# EAGLE design K0N16_Keypad_v1_1 (EAGLE 9.6.2)

## Sheet 1 of 2: MCU and Power Supply
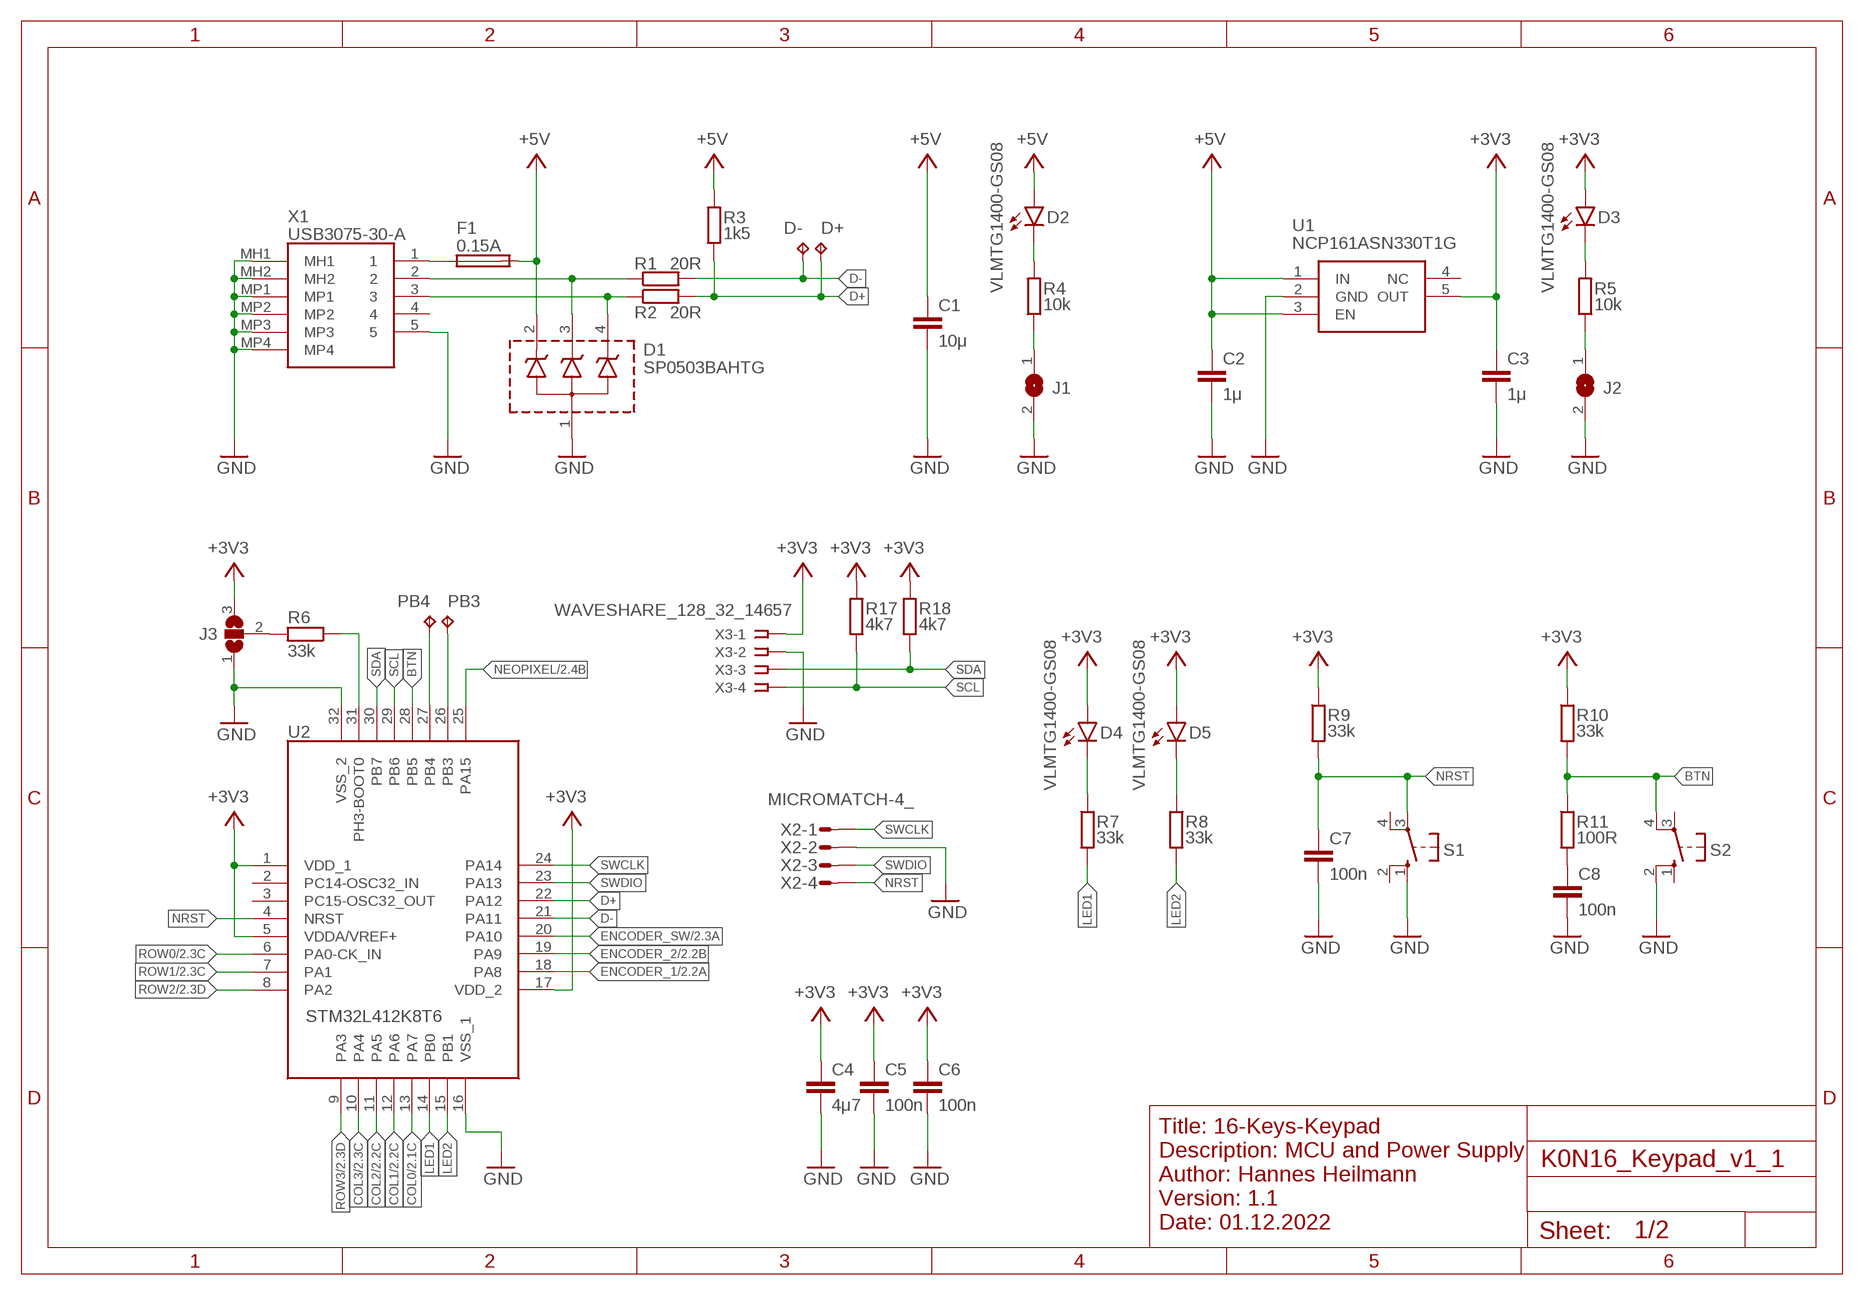
[diagram p0: schematic, sheet 1]

### Parts
C1  10μ  C_1206C1206  [C1206]
C2  1μ  C_0805  [C0805]
C3  1μ  C_0805  [C0805]
C4  4μ7  C_0805  [C0805]
C5  100n  C_0805  [C0805]
C6  100n  C_0805  [C0805]
C7  100n  C_0805  [C0805]
C8  100n  C_0805  [C0805]
D1  SP0503BAHTG  [SP0503BAHTG]
D2  VLMTG1400-GS08  LED_0805  [CHIP-LED0805]
D3  VLMTG1400-GS08  LED_0805  [CHIP-LED0805]
D4  VLMTG1400-GS08  LED_0805  [CHIP-LED0805]
D5  VLMTG1400-GS08  LED_0805  [CHIP-LED0805]
D+  TPB1,27  [B1,27]
D-  TPB1,27  [B1,27]
F1  FUSE_0603R0603  [R0603]
J1  SJ  [SJ]
J2  SJ  [SJ]
J3  SJ2W  [SJ_2]
PB3  TPB1,27  [B1,27]
PB4  TPB1,27  [B1,27]
R1  20R  R_0805  [R0805]
R2  20R  R_0805  [R0805]
R3  1k5  R_0805  [R0805]
R4  10k  R_0805  [R0805]
R5  10k  R_0805  [R0805]
R6  33k  R_0805  [R0805]
R7  33k  R_0805  [R0805]
R8  33k  R_0805  [R0805]
R9  33k  R_0805  [R0805]
R10  33k  R_0805  [R0805]
R11  100R  R_0805  [R0805]
R17  4k7  R_0805  [R0805]
R18  4k7  R_0805  [R0805]
S1  10-XXB3F_10XX  [B3F-10XX]
S2  10-XXB3F_10XX  [B3F-10XX]
U1  NCP161ASN330T1G  [SOT95P280X145-5N]
U2  STM32L412K8T6  [QFP80P900X900X160-32N]
X1  USB3075-30-A  [USB307530A]
X2  MICROMATCH-4_  [MICROMATCH-4]
X3  WAVESHARE_128_32_14657  [SSW-104-02-G-S]

### Nets
+3V3: C3.1 C4.1 C5.1 C6.1 D3.A D4.A D5.A J3.3 R9.1 R10.1 R17.1 R18.1 U1.5(OUT) U2.1(VDD_1) U2.5(VDDA/VREF+) U2.17(VDD_2) X3.1 ; also sheet 2
+5V: C1.1 C2.1 D1.2(K_1) D2.A F1.2 R3.2 U1.1(IN) U1.3(EN) ; also sheet 2
BOOT0: R6.1 U2.31(PH3-BOOT0)
BTN: R10.2 R11.1 S2.4(P1) U2.28(PB5)
COL0: U2.13(PA7) ; also sheet 2
COL1: U2.12(PA6) ; also sheet 2
COL2: U2.11(PA5) ; also sheet 2
COL3: U2.10(PA4) ; also sheet 2
D+: D+.TP R2.2 R3.1 U2.22(PA12)
D-: D-.TP R1.2 U2.21(PA11)
ENCODER_1: U2.18(PA8) ; also sheet 2
ENCODER_2: U2.19(PA9) ; also sheet 2
ENCODER_SW: U2.20(PA10) ; also sheet 2
GND: C1.2 C2.2 C3.2 C4.2 C5.2 C6.2 C7.2 C8.2 D1.1(COMMON_A) J1.2 J2.2 J3.1 S1.1(S) S2.2(S1) U1.2(GND) U2.16(VSS_1) U2.32(VSS_2) X1.5 X1.MH1 X1.MH2 X1.MP1 X1.MP2 X1.MP3 X1.MP4 X2.2 X3.2 ; also sheet 2
LED1: R7.2 U2.14(PB0)
LED2: R8.2 U2.15(PB1)
N$1: D1.3(K_2) R1.1 X1.2
N$2: D1.4(K_3) R2.1 X1.3
N$3: D2.C R4.2
N$4: J1.1 R4.1
N$5: J2.1 R5.1
N$6: D3.C R5.2
N$7: J3.2 R6.2
N$10: PB4.TP U2.27(PB4)
N$11: PB3.TP U2.26(PB3)
N$12: F1.1 X1.1
N$15: C8.1 R11.2
N$16: D4.C R7.1
N$18: D5.C R8.1
NEOPIXEL: U2.25(PA15) ; also sheet 2
NRST: C7.1 R9.2 S1.3(P) U2.4(NRST) X2.4
ROW0: U2.6(PA0-CK_IN) ; also sheet 2
ROW1: U2.7(PA1) ; also sheet 2
ROW2: U2.8(PA2) ; also sheet 2
ROW3: U2.9(PA3) ; also sheet 2
SCL: R17.2 U2.29(PB6) X3.4
SDA: R18.2 U2.30(PB7) X3.3
SWCLK: U2.24(PA14) X2.1
SWDIO: U2.23(PA13) X2.3
Unconnected: S1.2(S1) S1.4(P1) S2.1(S) S2.3(P) U1.4(NC) U2.2(PC14-OSC32_IN) U2.3(PC15-OSC32_OUT) X1.4

### Notes on the sheet
- 0.15A
- Title: 16-Keys-Keypad
  Description: MCU and Power Supply
  Author: Hannes Heilmann
  Version: 1.1
  Date: 01.12.2022

## Sheet 2 of 2: IO
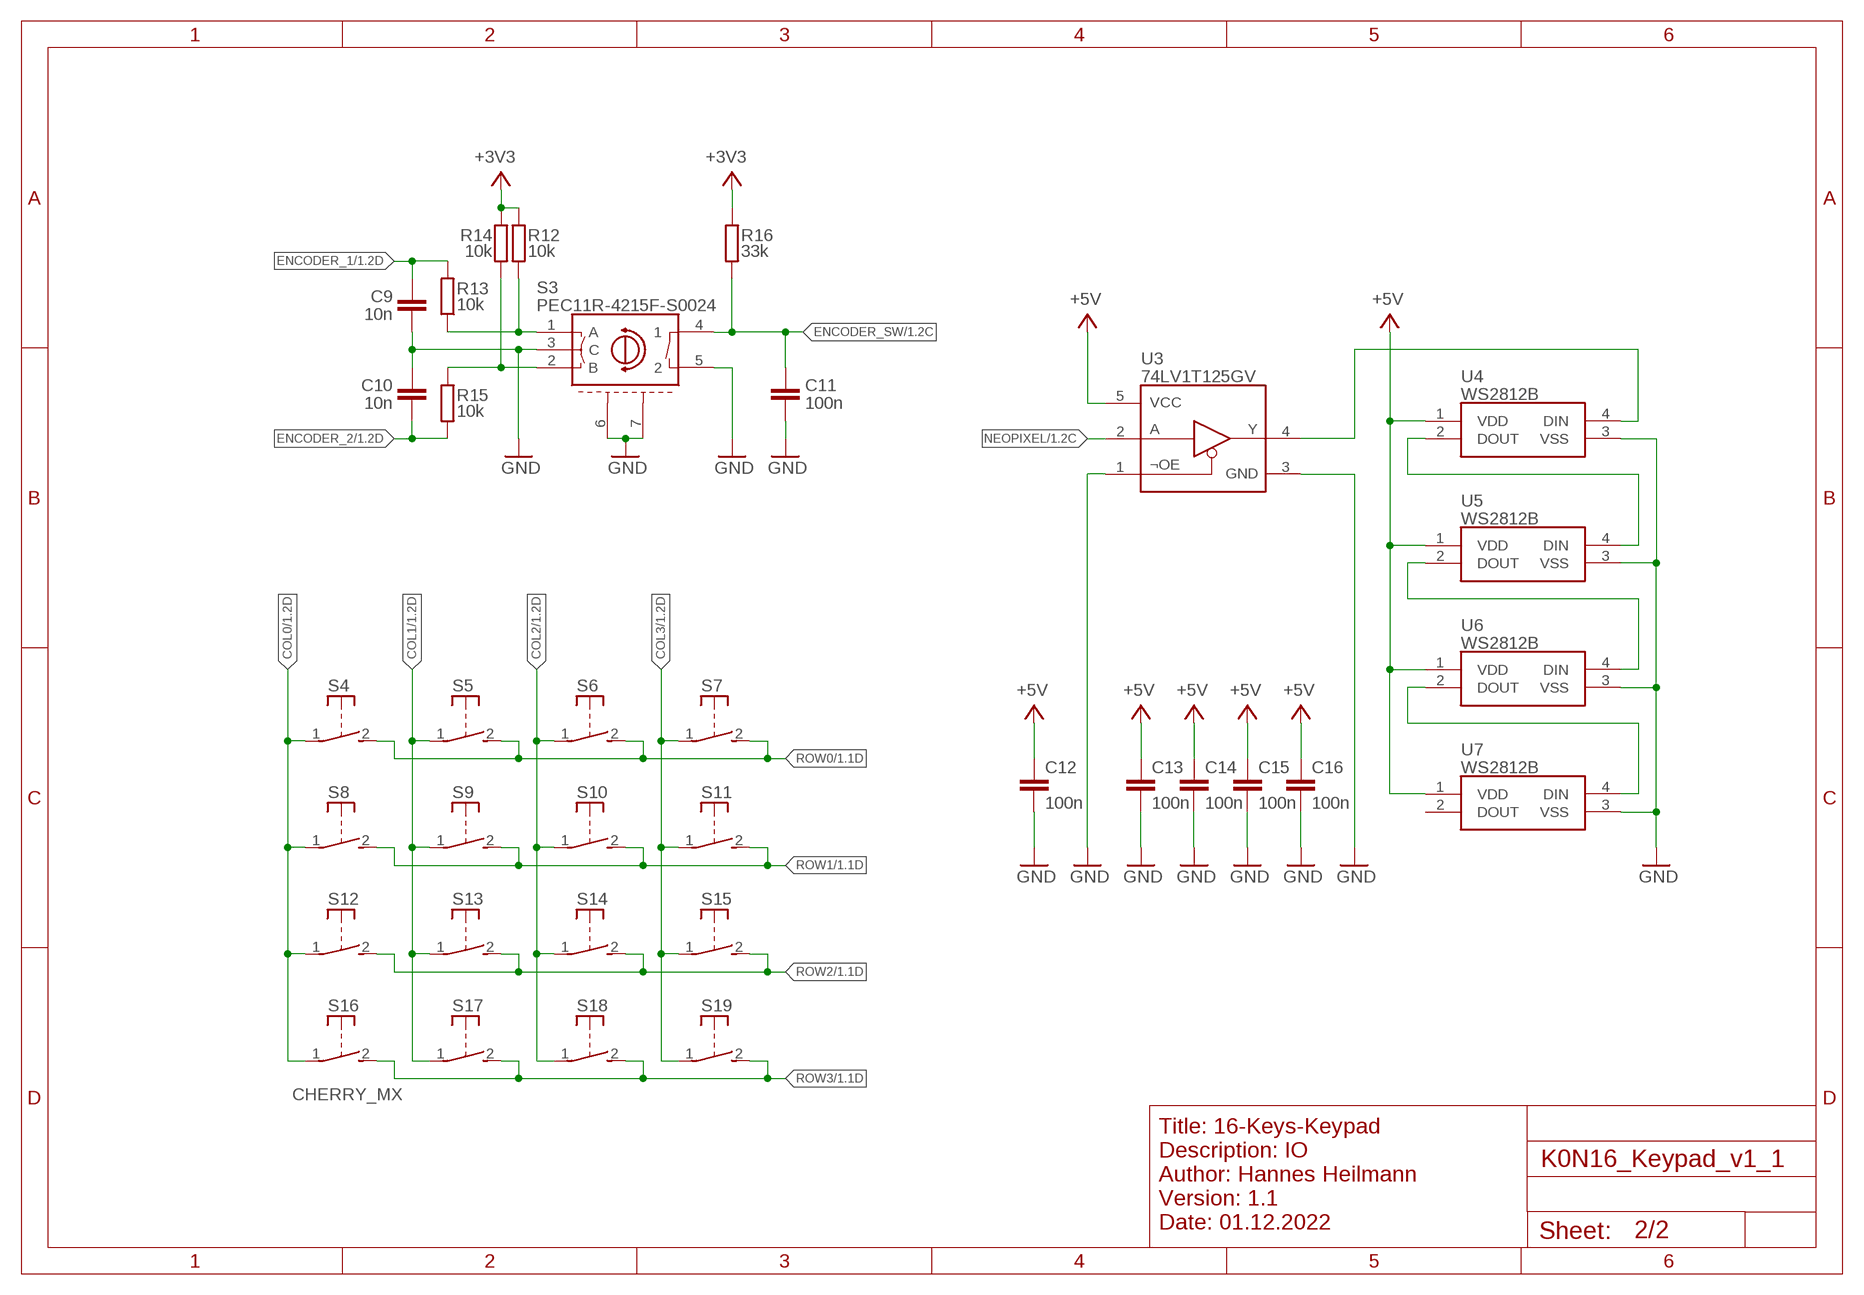
[diagram p1: schematic, sheet 2]

### Parts
C9  10n  C_0805  [C0805]
C10  10n  C_0805  [C0805]
C11  100n  C_0805  [C0805]
C12  100n  C_0805  [C0805]
C13  100n  C_0805  [C0805]
C14  100n  C_0805  [C0805]
C15  100n  C_0805  [C0805]
C16  100n  C_0805  [C0805]
R12  10k  R_0805  [R0805]
R13  10k  R_0805  [R0805]
R14  10k  R_0805  [R0805]
R15  10k  R_0805  [R0805]
R16  33k  R_0805  [R0805]
S3  PEC11R-4215F-S0024  [PEC12R-4XXXF-SXXXX_1]
S4  CHERRY_MX  [CHERRY_MX]
S5  CHERRY_MX  [CHERRY_MX]
S6  CHERRY_MX  [CHERRY_MX]
S7  CHERRY_MX  [CHERRY_MX]
S8  CHERRY_MX  [CHERRY_MX]
S9  CHERRY_MX  [CHERRY_MX]
S10  CHERRY_MX  [CHERRY_MX]
S11  CHERRY_MX  [CHERRY_MX]
S12  CHERRY_MX  [CHERRY_MX]
S13  CHERRY_MX  [CHERRY_MX]
S14  CHERRY_MX  [CHERRY_MX]
S15  CHERRY_MX  [CHERRY_MX]
S16  CHERRY_MX  [CHERRY_MX]
S17  CHERRY_MX  [CHERRY_MX]
S18  CHERRY_MX  [CHERRY_MX]
S19  CHERRY_MX  [CHERRY_MX]
U3  74LV1T125GV_  [SOT753]
U4  WS2812B  [WS2812B]
U5  WS2812B  [WS2812B]
U6  WS2812B  [WS2812B]
U7  WS2812B  [WS2812B]

### Nets
+3V3: R12.1 R14.1 R16.1 ; also sheet 1
+5V: C12.1 C13.1 C14.1 C15.1 C16.1 U3.5(VCC) U4.1(VDD) U5.1(VDD) U6.1(VDD) U7.1(VDD) ; also sheet 1
COL0: S4.1(P) S8.1(P) S12.1(P) S16.1(P) ; also sheet 1
COL1: S5.1(P) S9.1(P) S13.1(P) S17.1(P) ; also sheet 1
COL2: S6.1(P) S10.1(P) S14.1(P) S18.1(P) ; also sheet 1
COL3: S7.1(P) S11.1(P) S15.1(P) S19.1(P) ; also sheet 1
ENCODER_1: C9.1 R13.2 ; also sheet 1
ENCODER_2: C10.2 R15.2 ; also sheet 1
ENCODER_SW: C11.1 R16.2 S3.4 ; also sheet 1
GND: C9.2 C10.1 C11.2 C12.2 C13.2 C14.2 C15.2 C16.2 S3.3(C) S3.5 S3.6(GND1) S3.7(GND2) U3.1(¬OE) U3.3(GND) U4.3(VSS) U5.3(VSS) U6.3(VSS) U7.3(VSS) ; also sheet 1
N$8: R12.2 R13.1 S3.1(A)
N$9: R14.2 R15.1 S3.2(B)
N$20: U4.2(DOUT) U5.4(DIN)
N$21: U5.2(DOUT) U6.4(DIN)
N$22: U6.2(DOUT) U7.4(DIN)
N$24: U3.4(Y) U4.4(DIN)
NEOPIXEL: U3.2(A) ; also sheet 1
ROW0: S4.2(S) S5.2(S) S6.2(S) S7.2(S) ; also sheet 1
ROW1: S8.2(S) S9.2(S) S10.2(S) S11.2(S) ; also sheet 1
ROW2: S12.2(S) S13.2(S) S14.2(S) S15.2(S) ; also sheet 1
ROW3: S16.2(S) S17.2(S) S18.2(S) S19.2(S) ; also sheet 1
Unconnected: U7.2(DOUT)

### Notes on the sheet
- Title: 16-Keys-Keypad
  Description: IO
  Author: Hannes Heilmann
  Version: 1.1
  Date: 01.12.2022

## Library data of the parts
C1 = K0N16_Keypad_Collection:C_1206: CAPACITOR, European symbol
C2-C16 = K0N16_Keypad_Collection:C_0805: CAPACITOR, European symbol
D1 = K0N16_Keypad_Collection:SP0503BAHTG: ESD Suppressors / TVS Diodes TVS AVAL DIODE SMT Source: Datasheet <https://nl.mouser.com/datasheet/2/240/Littelfuse_TVS_Diode_Array_SP05_Datasheet.pdf-777043.pdf>; ARROW_PART_NUMBER: SP0503BAHTG; ARROW_PRICE-STOCK: https://www.arrow.com/en/products/sp0503bahtg/littelfuse?region=nac; DESCRIPTION: ESD Suppressors / TVS Diodes TVS AVAL DIODE SMT; HEIGHT: 1.22mm; MANUFACTURER_NAME: LITTELFUSE; MANUFACTURER_PART_NUMBER: SP0503BAHTG; MOUSER_PART_NUMBER: 576-SP0503BAHTG; MOUSER_PRICE-STOCK: https://www.mouser.co.uk/ProductDetail/Littelfuse/SP0503BAHTG?qs=uD%2FdkN7XIa0NTYXwHdELYA%3D%3D
D2-D5 = K0N16_Keypad_Collection:LED_0805: LED OSRAM: - CHIPLED LG R971, LG N971, LY N971, LG Q971, LY Q971, LO R971, LY R971 LH N974, LH R974 LS Q976, LO Q976, LY Q976 LO Q996 - Hyper CHIPLED LW Q18S LB Q993, LB Q99A, LB R99A - SideLED LS A670, LO A670, LY A670, LG A670, LP A670 LB A673, LV A673, LT A673, LW A673 LH A674 LY A675 LS A676, LA A676, LO A676, LY A676, LW A676 LS A679, LY A679, LG A679 - Hyper Micro SIDELED® LS Y876, LA Y876, LO Y876, LY Y876 LT Y87S - SmartLED LW L88C, LW L88S LB L89C, LB L89S, LG L890 LS L89K, LO L89K, LY L89K LS L896, LA L896, LO L896, LY L896 - TOPLED LS T670, LO T670, LY T670, LG T670, LP T670 LSG T670, LSP T670, LSY T670, LOP T670, LYG T670 LG T671, LOG T671, LSG T671 LB T673, LV T673, LT T673, LW T673 LH T674 LS T676, LA T676, LO T676, LY T676, LB T676, LH T676, LSB T676, LW T676 LB T67C, LV T67C, LT T67C, LS T67K, LO T67K, LY T67K, LW E67C LS E67B, LA E67B, LO E67B, LY E67B, LB E67C, LV E67C, LT E67C LW T67C LS T679, LY T679, LG T679 LS T770, LO T770, LY T770, LG T770, LP T770 LB T773, LV T773, LT T773, LW T773 LH T774 LS E675, LA E675, LY E675, LS T675 LS T776, LA T776, LO T776, LY T776, LB T776 LHGB T686 LT T68C, LB T68C - Hyper Mini TOPLED® LB M676 - Mini TOPLED Santana® LG M470 LS M47K, LO M47K, LY M47K Source: http://www.osram.convergy.de LUXEON: - LUMILED® LXK2-PW12-R00, LXK2-PW12-S00, LXK2-PW14-U00, LXK2-PW14-V00 LXK2-PM12-R00, LXK2-PM12-S00, LXK2-PM14-U00 LXK2-PE12-Q00, LXK2-PE12-R00, LXK2-PE12-S00, LXK2-PE14-T00, LXK2-PE14-U00 LXK2-PB12-K00, LXK2-PB12-L00, LXK2-PB12-M00, LXK2-PB14-N00, LXK2-PB14-P00, LXK2-PB14-Q00 LXK2-PR12-L00, LXK2-PR12-M00, LXK2-PR14-Q00, LXK2-PR14-R00 LXK2-PD12-Q00, LXK2-PD12-R00, LXK2-PD12-S00 LXK2-PH12-R00, LXK2-PH12-S00 LXK2-PL12-P00, LXK2-PL12-Q00, LXK2-PL12-R00 Source: www.luxeon.com KINGBRIGHT: KA-3528ASYC Source: www.kingbright.com
D+ D- PB3 PB4 = testpad:TP: Test pad
F1 = K0N16_Keypad_Collection:FUSE_0603
J1 J2 = jumper:SJ: SMD solder JUMPER
J3 = jumper:SJ2W: SMD solder JUMPER
R1-R18 = K0N16_Keypad_Collection:R_0805: RESISTOR, European symbol
S1 S2 = K0N16_Keypad_Collection:10-XX: OMRON SWITCH
S3 = K0N16_Keypad_Collection:PEC11R-4215F-S0024: Incremental encoder 24 detents 24 pulses Source: Datasheet <https://componentsearchengine.com/Datasheets/1/PEC11R-4225F-S0024.pdf>; ARROW_PART_NUMBER: PEC11R-4225F-S0024; ARROW_PRICE-STOCK: https://www.arrow.com/en/products/pec11r-4225f-s0024/bourns?region=nac; DESCRIPTION: Incremental encoder 24 detents 24 pulses; HEIGHT: mm; MANUFACTURER_NAME: Bourns; MANUFACTURER_PART_NUMBER: PEC11R-4225F-S0024; MOUSER_PART_NUMBER: 652-PEC11R-4225F-S24; MOUSER_PRICE-STOCK: https://www.mouser.co.uk/ProductDetail/Bourns/PEC11R-4225F-S0024?qs=Zq5ylnUbLm4N6UNkPX3pkQ%3D%3D
S4-S19 = K0N16_Keypad_Collection:CHERRY_MX: Pushbutton Switches Full Travel, Mech. Keyswitch, Click Tactile Feel (Blue stem), 60cN, No LED, No Diode, Fixation Pins for PCB Mounting Source: Datasheet <https://media.digikey.com/pdf/Data Sheets/Cherry PDFs/MX Series.pdf>; ARROW_PART_NUMBER: MX1A-E1NW; ARROW_PRICE-STOCK: https://www.arrow.com/en/products/mx1a-e1nw/cherry-americas-llc?region=nac; DESCRIPTION: Pushbutton Switches Full Travel, Mech. Keyswitch, Click Tactile Feel (Blue stem), 60cN, No LED, No Diode, Fixation Pins for PCB Mounting; HEIGHT: 15.2mm; MANUFACTURER_NAME: Cherry; MANUFACTURER_PART_NUMBER: MX1A-E1NW; MOUSER_PART_NUMBER: 540-MX1A-E1NW; MOUSER_PRICE-STOCK: https://www.mouser.co.uk/ProductDetail/CHERRY/MX1A-E1NW?qs=Z7NFYKyvgJd45Wm4xzFv7w%3D%3D
U1 = K0N16_Keypad_Collection:NCP161ASN330T1G: ON SEMICONDUCTOR - NCP161ASN330T1G - Fixed LDO Voltage Regulator, 1.9V to 5.5V, 225mV drop, 3.3V/450mA out, SOT-23-5 Source: Datasheet <https://componentsearchengine.com/Datasheets/2/NCP161ASN330T1G.pdf>; ARROW_PART_NUMBER: NCP161ASN330T1G; ARROW_PRICE-STOCK: https://www.arrow.com/en/products/ncp161asn330t1g/on-semiconductor?region=nac; DESCRIPTION: ON SEMICONDUCTOR - NCP161ASN330T1G - Fixed LDO Voltage Regulator, 1.9V to 5.5V, 225mV drop, 3.3V/450mA out, SOT-23-5; HEIGHT: 1.45mm; MANUFACTURER_NAME: onsemi; MANUFACTURER_PART_NUMBER: NCP161ASN330T1G; MOUSER_PART_NUMBER: 863-NCP161ASN330T1G; MOUSER_PRICE-STOCK: https://www.mouser.co.uk/ProductDetail/onsemi/NCP161ASN330T1G?qs=vLWxofP3U2ze5zA%252BHmAd3w%3D%3D
U2 = K0N16_Keypad_Collection:STM32L412K8T6: STMICROELECTRONICS - STM32L412K8T6 - ARM MCU, STM32 Family STM32L4 Series Microcontrollers, ARM Cortex-M4, 32bit, 80 MHz, 128 KB, 40 KB Source: Datasheet <https://www.mouser.com/datasheet/2/389/stm32l412c8-1505426.pdf>; ARROW_PART_NUMBER: STM32L412K8T6; ARROW_PRICE-STOCK: https://www.arrow.com/en/products/stm32l412k8t6/stmicroelectronics?region=nac; DESCRIPTION: STMICROELECTRONICS - STM32L412K8T6 - ARM MCU, STM32 Family STM32L4 Series Microcontrollers, ARM Cortex-M4, 32bit, 80 MHz, 128 KB, 40 KB; HEIGHT: 1.6mm; MANUFACTURER_NAME: STMicroelectronics; MANUFACTURER_PART_NUMBER: STM32L412K8T6; MOUSER_PART_NUMBER: 511-STM32L412K8T6; MOUSER_PRICE-STOCK: https://www.mouser.co.uk/ProductDetail/STMicroelectronics/STM32L412K8T6?qs=l7cgNqFNU1gVMdP83FyqDw%3D%3D
U3 = K0N16_Keypad_Collection:74LV1T125GV
U4-U7 = K0N16_Keypad_Collection:WS2812B
X1 = K0N16_Keypad_Collection:USB3075-30-A: GCT (GLOBAL CONNECTOR TECHNOLOGY) - USB3075-30-A - USB Connector, Micro USB Type B, USB 2.0, Receptacle, 5 Ways, Surface Mount, Right Angle Source: Datasheet <https://componentsearchengine.com/Datasheets/2/USB3075-30-A.pdf>; DESCRIPTION: GCT (GLOBAL CONNECTOR TECHNOLOGY) - USB3075-30-A - USB Connector, Micro USB Type B, USB 2.0, Receptacle, 5 Ways, Surface Mount, Right Angle; HEIGHT: 2.7mm; MANUFACTURER_NAME: GCT (GLOBAL CONNECTOR TECHNOLOGY); MANUFACTURER_PART_NUMBER: USB3075-30-A; MOUSER_PART_NUMBER: 640-USB3075-30-A; MOUSER_PRICE-STOCK: https://www.mouser.co.uk/ProductDetail/GCT/USB3075-30-A?qs=KUoIvG%2F9IlbGMJplbp1ybA%3D%3D
X2 = K0N16_Keypad_Collection:MICROMATCH-4: MicroMaTch 4 7-215464-4 / 0-215464-4 Drawing Number C-215464 DDEController.pdf
X3 = K0N16_Keypad_Collection:WAVESHARE_128_32_14657: THROUGH-HOLE .025" SQ POST SOCKET Source: Samtec SSW.pdf; MF: Samtec Inc.; MPN: SSW-104-02-G-S; OC_FARNELL: unknown; OC_NEWARK: 11P9384

## Board
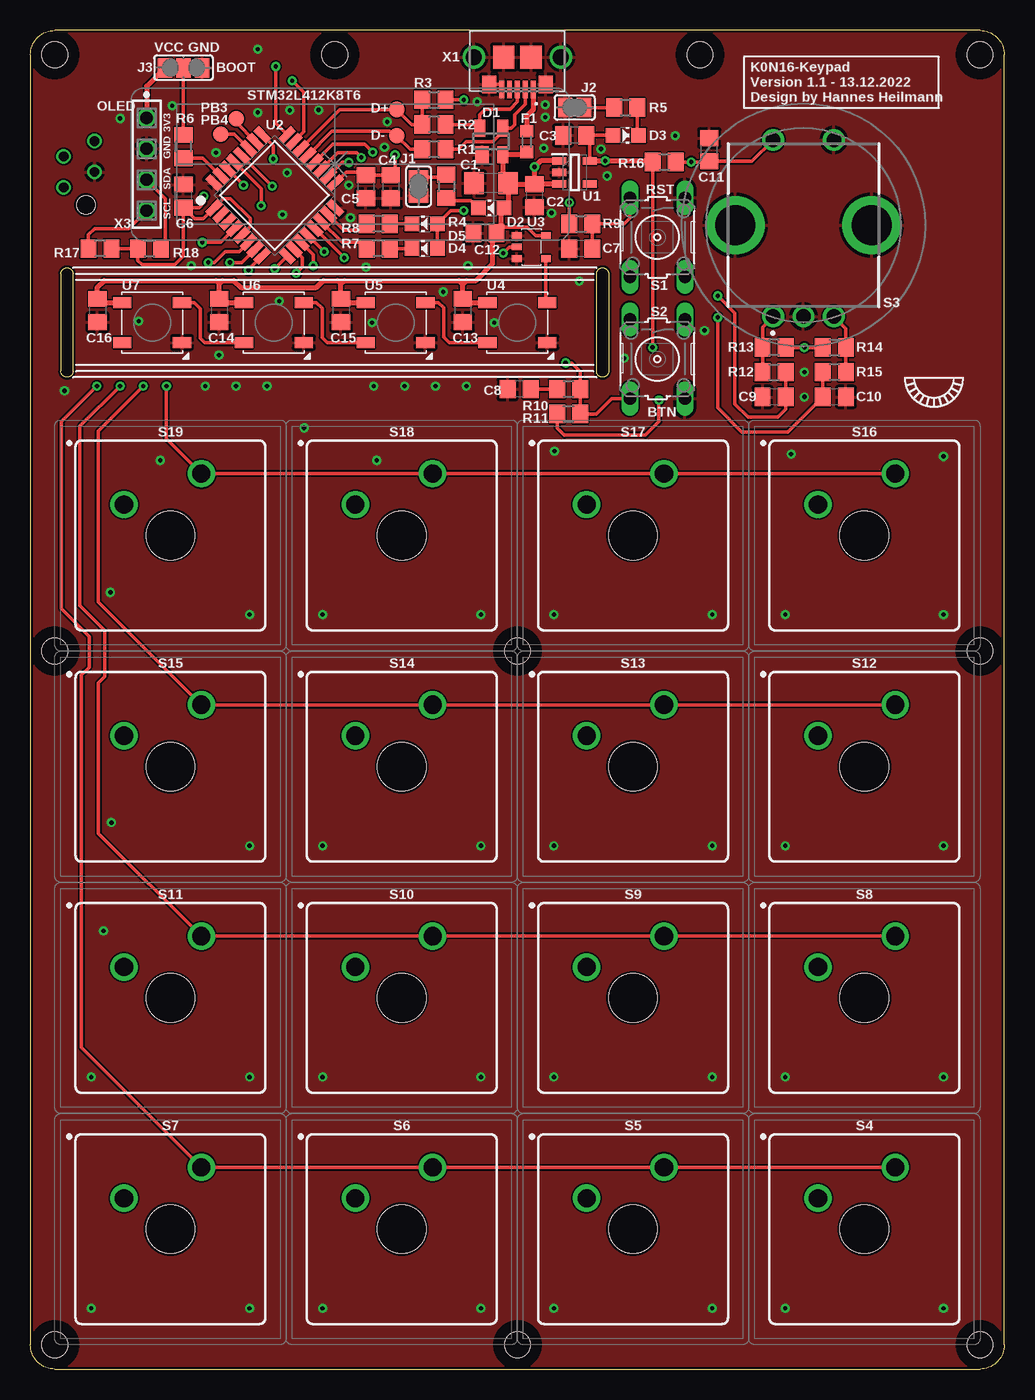
[diagram p2: board, top side]
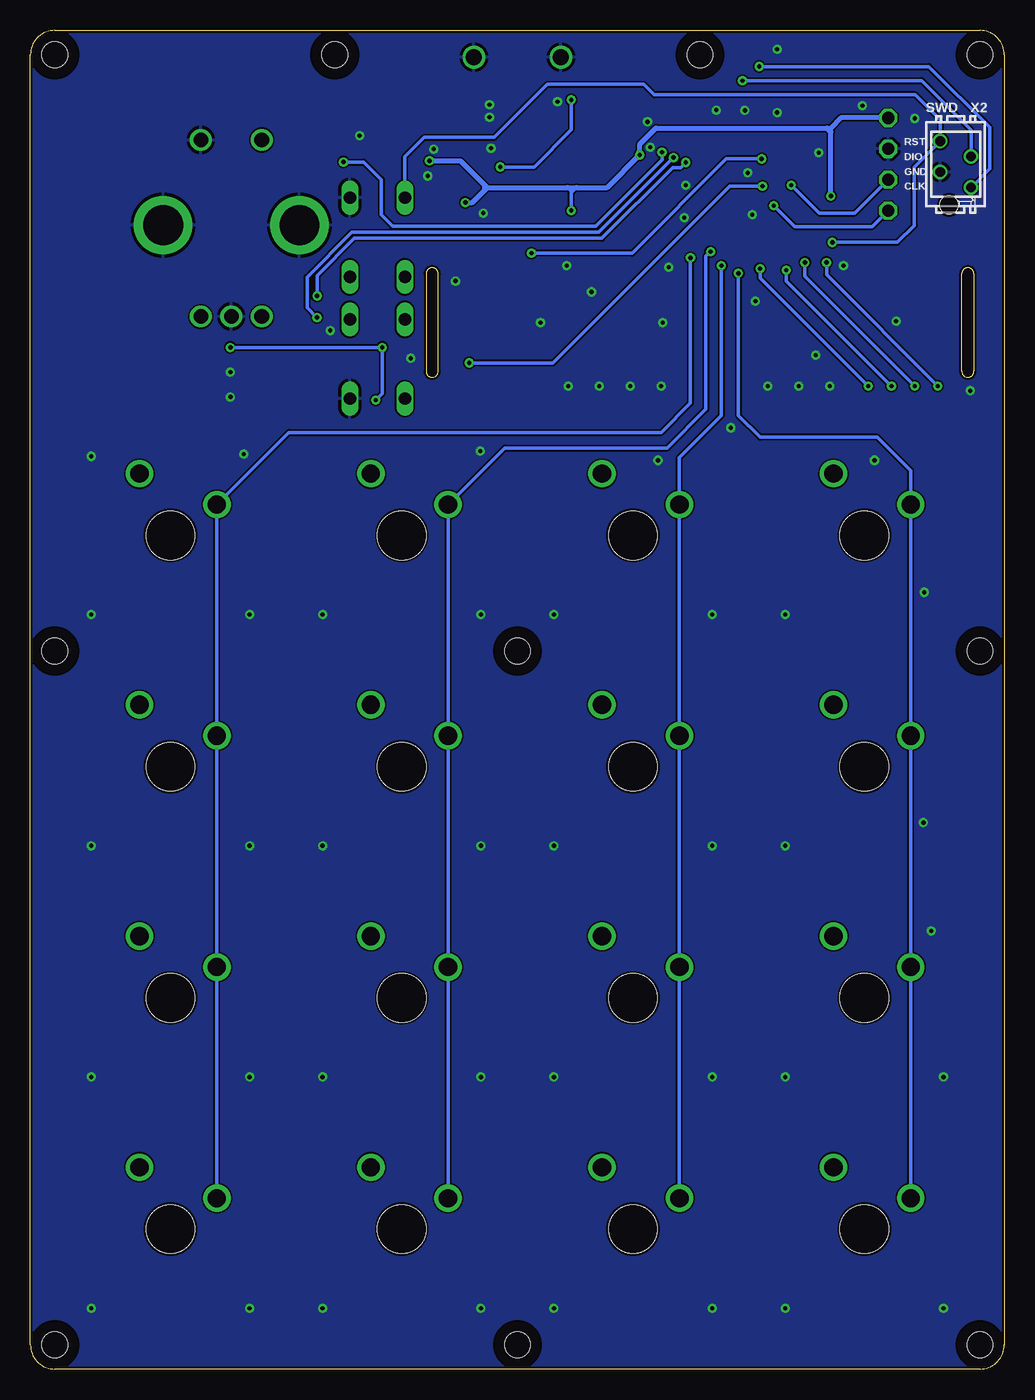
[diagram p3: board, bottom side, seen from below]

Size 80 x 110 mm. Coordinates in mm from the lower left corner, seen from the top.
Outline: 2,0 78,0 arc90 80,2 80,108 arc90 78,110 2,110 arc90 0,108 0,2 arc90 2,0
Outline: 3.5,82 arc-180 2.5,82 2.5,90 arc-180 3.5,90 3.5,82
Outline: 47.5,82 arc-180 46.5,82 46.5,90 arc-180 47.5,90 47.5,82
Copper layers (1*16): Top 0.035mm / dielectric 1.6mm / Bottom 0.035mm
Design rules "jlcpcb_2_layer *": minimum track width 5mil, minimum drill 0.2mm, track to track 5mil, track to pad 0.2mm, pad to pad 5mil, via to via 5mil, smd to smd 0mil, copper to edge 0.2mm, drill to drill 0.5mm, minimum pad ring 0.2mm, minimum via ring 0.2mm, stop-mask expansion 4mil, vias tented up to drill 0mil, thermal gap 10mil
Holes 2.1 mm at 40,2 78,2 2,2 40,59 78,59 2,59 25,108 55,108 2,108 78,108
tRestrict: area 76,0 to 80,4; area 38,0 to 42,4; area 0,0 to 4,4; area 0,57 to 4,61; area 38,57 to 42,61; area 76,57 to 80,61; area 76,106 to 80,110; area 53,106 to 57,110; area 23,106 to 27,110; area 0,106 to 4,110
bRestrict: area 76,0 to 80,4; area 38,0 to 42,4; area 0,0 to 4,4; area 0,57 to 4,61; area 38,57 to 42,61; area 76,57 to 80,61; area 0,106 to 4,110; area 23,106 to 27,110; area 53,106 to 57,110; area 76,106 to 80,110

### Footprints (pad centres in the part's own frame; a part is rotated, then mirrored left to right if it is on the bottom)
C1206 = smd 1.6 x 1.8: 1 -1.4,0; 2 1.4,0
C0805 = smd 1.3 x 1.5: 1 -0.95,0; 2 0.95,0
SP0503BAHTG = smd 1.1 x 1.4: 1 -0.75,-1.1 | smd 0.9 x 1.4: 2 0.95,-1.1; 3 0.95,1.1; 4 -0.95,1.1
CHIP-LED0805 = smd 1.2 x 1.2: A 0,-1.05; C 0,1.05
B1,27 = smd 1.27 x 1.27: TP 0,0
R0603 = smd 1 x 1.1: 1 -0.85,0; 2 0.85,0
SJ = smd 1.168 x 1.6: 1 -0.762,0; 2 0.762,0
SJ_2 = smd 1.168 x 1.6: 1 -1.524,0; 2 0,0; 3 1.524,0
R0805 = smd 1.3 x 1.5: 1 -0.95,0; 2 0.95,0
B3F-10XX = drill 1.016 long: 1 -3.251,2.261; 2 3.251,2.261; 3 -3.251,-2.261; 4 3.251,-2.261
PEC12R-4XXXF-SXXXX_1 = drill 1.2 pad 1.8: 1 -2.5,-7.5; 2 2.5,-7.5; 3 0,-7.5; 4 -2.5,7; 5 2.5,7 | drill 3.28 pad 4.8: 6 5.6,0; 7 -5.6,0
CHERRY_MX = drill 1.499 pad 2.248: 1 -3.81,2.54; 2 2.54,5.08 | hole 3.988: 0,0
SOT95P280X145-5N = smd 1.15 x 0.6: 1 -1.25,0.95; 2 -1.25,0; 3 -1.25,-0.95; 4 1.25,-0.95; 5 1.25,0.95
QFP80P900X900X160-32N = smd 1.475 x 0.6: 1 -4.238,2.8; 2 -4.238,2; 3 -4.238,1.2; 4 -4.238,0.4; 5 -4.238,-0.4; 6 -4.238,-1.2; 7 -4.238,-2; 8 -4.238,-2.8; 17 4.238,-2.8; 18 4.238,-2; 19 4.238,-1.2; 20 4.238,-0.4; 21 4.238,0.4; 22 4.238,1.2; 23 4.238,2; 24 4.238,2.8 | smd 0.6 x 1.475: 9 -2.8,-4.238; 10 -2,-4.238; 11 -1.2,-4.238; 12 -0.4,-4.238; 13 0.4,-4.238; 14 1.2,-4.238; 15 2,-4.238; 16 2.8,-4.238; 25 2.8,4.238; 26 2,4.238; 27 1.2,4.238; 28 0.4,4.238; 29 -0.4,4.238; 30 -1.2,4.238; 31 -2,4.238; 32 -2.8,4.238
SOT753 = smd 0.8 x 0.55: 1 -1.2,0.95; 2 -1.2,0; 3 -1.2,-0.95; 4 1.2,-0.95; 5 1.2,0.95
WS2812B = smd 1.5 x 0.9: 1 -2.45,1.65; 2 -2.45,-1.65; 3 2.45,-1.65; 4 2.45,1.65
USB307530A = smd 0.4 x 1.4: 1 -1.3,2.65; 2 -0.65,2.65; 3 0,2.65; 4 0.65,2.65; 5 1.3,2.65 | drill 1.329 pad 1.85: MH1 -3.575,0; MH2 3.575,0 | smd 1.75 x 1.9: MP1 -1.125,0; MP2 1.125,0 | smd 1.15 x 1.45: MP3 -2.32,2.23; MP4 2.32,2.23
MICROMATCH-4 = drill 0.8: 1 1.905,1.27; 2 0.635,-1.27; 3 -0.635,1.27; 4 -1.905,-1.27 | hole 1.5: 3.34,-0.55
SSW-104-02-G-S = drill 1 pad 1.5 octagon: 1 -15.46,3.81; 2 -15.46,1.27; 3 -15.46,-1.27; 4 -15.46,-3.81

### Placement (x,y rotation side)
C1  37.85,97.44 180 top
C2  41.4,96.43 270 top
C3  44.7,101.38 180 top
C4  29.59,97.16 270 top
C5  27.56,97.16 270 top
C6  12.57,96.39 90 top
C7  45.21,92.08 180 top
C8  40.15,80.52 180 top
C9  61.09,79.88 180 top
C10  66.04,79.88 180 top
C11  55.75,100.2 90 top
C12  37.34,93.34 180 top
C13  35.51,86.98 270 top
C14  15.51,86.98 270 top
C15  25.51,86.98 270 top
C16  5.51,86.98 270 top
D1  37.85,100.87 0 top
D2  37.85,95.41 90 top
D3  48.9,101.38 270 top
D4  32.38,92.08 90 top
D5  32.38,94.11 90 top
D+  30.1,103.5 0 top
D-  30.1,101.35 0 top
F1  40.77,100.87 270 top
J1  31.88,97.19 270 top
J2  44.7,103.67 180 top
J3  12.57,106.93 180 top
PB3  16.89,102.74 0 top
PB4  15.62,101.47 0 top
R1  33.15,100.24 180 top
R2  33.15,102.27 180 top
R3  33.15,104.3 0 top
R4  34.16,97.19 270 top
R5  48.9,103.67 0 top
R6  12.57,100.46 90 top
R7  28.57,92.08 180 top
R8  28.57,94.11 180 top
R9  45.21,94.11 0 top
R10  44.21,78.49 0 top
R11  44.21,80.52 180 top
R12  61.09,83.95 180 top
R13  61.09,81.92 0 top
R14  66.04,83.95 0 top
R15  66.04,81.92 180 top
R16  52.07,99.19 0 top
R17  5.71,92.08 180 top
R18  9.78,92.08 0 top
S1  51.5,93 270 top
S2  51.5,83 270 top
S3  63.5,94 0 top
S4  68.5,11.5 0 top
S5  49.5,11.5 0 top
S6  30.5,11.5 0 top
S7  11.5,11.5 0 top
S8  68.5,30.5 0 top
S9  49.5,30.5 0 top
S10  30.5,30.5 0 top
S11  11.5,30.5 0 top
S12  68.5,49.5 0 top
S13  49.5,49.5 0 top
S14  30.5,49.5 0 top
S15  11.5,49.5 0 top
S16  68.5,68.5 0 top
S17  49.5,68.5 0 top
S18  30.5,68.5 0 top
S19  11.5,68.5 0 top
U1  44.7,98.33 0 top
U2  20.06,96.45 45 top
U3  41.15,92.2 0 top
U4  40,86 0 top
U5  30,86 0 top
U6  20,86 0 top
U7  10,86 0 top
X1  40,107.8 180 top
X2  4,99 270 bottom
X3  25,99 0 top

### Tracks (layer width: path | path; a pad name or v marks a point on that pad's centre or on a via)
+3V3  (via drill 0.35)
  Top 0.305: C6.1 13.48,94.54 14.19,94.54 U2.1 15.85,96.19 16.43,96.19 18.06,94.56 18.06,93.88 U2.5 | U2.17 25.93,98.36 27.3,98.36 C5.1 C4.1 29.95,98.46 v29.95,99.77 | D4.A D5.A 34.53,95.2 v35.59,95.2 | D3.A C3.1 45.95,101.08 U1.5 | R17.1 R18.1 8.83,91.09 9.17,90.75 11.86,90.75 12.57,91.47 C6.1 | v14.25,96.39 14.25,95.83 13.86,95.44 C6.1 | v44.27,95.86 v44.26,95.85 R9.1 | v51.1,83.95 51.12,83.96 R16.1 | R10.1 43.26,77.33 43.86,76.73 50.51,76.73 51.63,77.85 v51.63,79.63 | R14.1 v63.58,83.95 R12.1
  Top 0.406: U1.5 v47.22,99.28 51.03,99.28 R16.1 | J3.3 9.54,105.42 X3.1
  Bottom 0.305: v51.63,79.63 51.1,80.15 v51.1,83.95 v63.58,83.95 | v35.59,95.2 35.59,96.77 | 35.59,96.77 35.53,96.72 35.18,97.08 35.15,97.08 | 35.59,96.77 35.89,97.08
  Bottom 0.406: v47.22,99.28 44.68,99.28 42.74,97.34 | 42.74,97.34 42.48,97.08 | 42.48,97.08 35.89,97.08 35.15,97.08 32.64,97.08 v29.95,99.77 29.95,100.66 28.63,101.98 14.58,101.98 | 14.58,101.98 14.25,101.98 | v14.25,96.39 14.25,101.65 | 14.25,101.65 14.25,101.98 | X3.1 13.42,102.81 14.25,101.98 | 14.25,101.65 14.58,101.98 | v44.27,95.86 43.7,95.86 42.74,96.82 | 42.74,96.82 42.48,97.08 | 42.74,97.34 42.74,96.82
+5V  (via drill 0.35)
  Top 0.305: R3.2 35.58,104.3 v35.59,104.29 | C12.1 38.8,93.85 40.82,93.85 41.52,93.15 U3.5
  Top 0.406: U7.1 5.79,87.65 C16.1 5.51,88.92 6.04,89.46 15.24,89.46 | U6.1 15.79,87.65 C14.1 15.51,89.19 | U5.1 25.79,87.65 C15.1 25.51,89.17 | U4.1 35.79,87.65 C13.1 35.51,89.16 | 15.24,89.46 15.78,89.46 | 15.78,89.46 16.71,89.46 17.3,88.88 23.47,88.88 24.05,89.46 25.22,89.46 | 25.22,89.46 25.79,89.46 | 25.79,89.46 35.2,89.46 | 35.2,89.46 35.81,89.46 | 15.51,89.19 15.24,89.46 | 15.51,89.19 15.78,89.46 | 25.51,89.17 25.22,89.46 | 25.51,89.17 25.79,89.46 | 35.51,89.16 35.2,89.46 | 35.51,89.16 35.81,89.46 | C1.1 39.25,95.76 D2.A 38.64,95.16 38.64,93.7 C12.1 37.95,93 37.95,90.81 36.6,89.46 35.81,89.46 | C1.1 39.31,97.38 C2.1 | U1.3 C2.1 | F1.2 40.52,99.77 D1.2 38.8,97.89 C1.1 | U1.1 41.9,99.28 v41.4,98.78 C2.1
  Bottom 0.305: v35.59,104.29 35.59,101.83 38.63,98.78 v41.4,98.78
BOOT0
  Top 0.305: U2.31 14.17,99.51 R6.1
BTN  (via drill 0.35)
  Top 0.305: U2.28 v19.86,97.21 | v43.96,82.68 44.46,82.68 45.16,81.97 R11.1 R10.2 46.49,78.49 47.75,79.75 S2.4
  Bottom 0.305: v19.86,97.21 22.55,97.21 37.08,82.68 v43.96,82.68
COL0  (via drill 0.35)
  Top 0.305: U2.13 25.76,91.31 v25.78,91.31
  Bottom 0.305: S4.1 S8.1 S12.1 S16.1 58.77,76.96 28.19,76.96 25.78,79.38 v25.78,91.31
COL1  (via drill 0.35)
  Top 0.305: U2.12 v24.12,91.82 v24.13,91.82
  Bottom 0.305: S5.1 S9.1 S13.1 S17.1 45.67,71.04 41.02,75.69 27.69,75.69 24.51,78.87 24.51,91.44 v24.13,91.82
COL2  (via drill 0.35)
  Top 0.305: U2.11 23.24,91.57 v23.24,90.68
  Bottom 0.305: S6.1 S10.1 S14.1 S18.1 26.69,74.91 23.24,78.36 v23.24,90.68
COL3  (via drill 0.35)
  Top 0.305: v21.84,90.04 22.34,90.54 22.34,91.34 U2.10
  Bottom 0.305: S7.1 S11.1 S15.1 S19.1 7.69,73.83 10.44,76.58 20.07,76.58 21.84,78.36 v21.84,90.04
D+
  Top 0.305: U2.22 25.42,103.5 D+.TP 31.34,102.27 R2.2 R3.1
D-
  Top 0.305: R1.2 31.18,100.24 30.1,101.32 D-.TP 29.88,101.35 29.52,101.7 24.75,101.7 U2.21
ENCODER_1  (via drill 0.35)
  Top 0.305: U2.18 25.6,99.16 v26.16,99.16 | R13.2 C9.1 62.04,78.88 61.37,78.21 58.98,78.21 57.87,79.31 57.87,86.77 v56.45,88.19
  Bottom 0.305: v26.16,99.16 26.59,98.72 27.25,98.72 33.06,92.91 53.39,92.91 56.45,89.85 v56.45,88.19
ENCODER_2  (via drill 0.35)
  Top 0.305: U2.19 25.25,99.93 26.8,99.93 v27.18,99.55 | R15.2 C10.2 62.22,77.01 58.45,77.01 56.46,78.99 v56.46,86.41
  Bottom 0.305: v27.18,99.55 33.31,93.42 53.59,93.42 57.28,89.74 57.28,87.22 v56.46,86.41
ENCODER_SW  (via drill 0.35)
  Top 0.305: R16.2 v54.28,99.19 55.69,99.19 C11.1 59.25,99.25 S3.4 | U2.20 24.84,100.66 27.46,100.66 v28.12,100
  Bottom 0.305: v28.12,100 28.12,99.36 33.55,93.93 50.24,93.93 51.18,94.87 51.18,97.74 52.63,99.19 v54.28,99.19
GND  (via drill 0.35)
  Top 0.305: X1.MP4 38.7,105.57 X1.5
  other vias: 13.21,90.68 8.89,86.11 15.49,83.31 20.45,87.76 28.07,85.98 33.91,88.52 35.94,90.68 27.56,90.55 48.77,83.06 38.1,85.98 42.8,95 47.37,98.04 42.16,100.33 42.29,103.89 42.29,102.87 36.7,104.14 21.31,103.43 18.67,103.25 15.24,99.95 45.09,89.41 26.16,97.28 26.29,94.61 23.67,103.45 29.08,100.41 29.31,102.49 46.86,100.25 52.96,101.35 55.37,85.34 63.58,81.92 63.58,79.88 22.48,77.34 14.35,80.77 16.89,80.77 19.43,80.77 28.19,80.77 30.73,80.77 33.27,80.77 35.81,80.77 28.45,74.68 43.05,75.44 62.48,75.18 10.67,74.68 18,62 24,62 43,62 37,62 56,62 62,62 6.65,44.91 18,43 24,43 37,43 43,43 56,43 62,43 75,43 75,62 75,75 18,24 5,24 18,5 5,5 24,5 37,5 43,5 56,5 24,24 37,24 43,24 56,24 62,24 62,5 75,5 75,24 2.79,80.39 20.7,94.87 21.08,98.3 11.66,103.81 7.37,102.77 18.67,108.46 6.57,63.83 6,36
  pour Top (rank 2): 0,110 80,110 80,0 0,0
  pour Bottom: 0,110 80,110 80,0 0,0
  pour Top (no thermals): 38.12,104.09 39.09,104.09 39.09,104.25 38.9,104.25 38.9,106.45 38.5,106.45 38.5,104.59 38.12,104.59
LED1
  Top 0.305: U2.14 25.62,92.58 27.12,92.58 R7.2
LED2
  Top 0.305: U2.15 25.74,93.6 27.12,93.6 R8.2
N$1
  Top 0.305: X1.2 40.65,103.95 39.79,103.08 39.79,102.25 39.51,101.97 D1.3 38.8,101.69 37.98,100.87 35.79,100.87 35.15,100.24 R1.1
N$2
  Top 0.305: X1.3 40,104.14 39.4,103.53 37.36,103.53 36.9,103.06 D1.4 36.6,102.27 R2.1
N$3
  Top 0.305: R4.2 34.38,96.02 36.19,96.02 D2.C
N$4
  Top 0.305: J1.1 33.98,97.95 R4.1
N$5
  Top 0.305: J2.1 R5.1
N$6
  Top 0.305: D3.C 49.84,101.48 R5.2
N$7
  Top 0.305: R6.2 J3.2
N$8
  Top 0.305: S3.1 60.14,85.64 60.14,84.15 R12.2 R13.1
N$9
  Top 0.305: S3.2 66.99,85.51 R14.2 R15.1
N$10
  Top 0.305: U2.27 16.73,101.47 PB4.TP
N$11
  Top 0.305: U2.26 16.89,102.44 PB3.TP
N$12
  Top 0.406: X1.1 41.3,103.48 40.77,102.95 F1.1
N$15
  Top 0.305: C8.1 R11.2
N$16
  Top 0.305: R7.1 D4.C
N$18
  Top 0.305: R8.1 D5.C
N$20
  Top 0.305: U5.4 33.51,87.65 33.93,87.22 33.93,84.81 34.4,84.35 U4.2
N$21
  Top 0.305: U6.4 23.48,87.65 23.95,87.17 23.95,84.76 24.36,84.35 U5.2
N$22
  Top 0.305: U7.4 13.44,87.65 13.95,87.15 13.95,84.73 14.33,84.35 U6.2
N$24
  Top 0.305: U4.4 42.35,87.75 U3.4
NEOPIXEL  (via drill 0.35)
  Top 0.305: U2.25 19.94,100.53 v19.94,99.44 | U3.2 39.34,92.2 v38.84,91.69
  Bottom 0.305: v19.94,99.44 22.84,99.44 30.58,91.69 v38.84,91.69
NRST  (via drill 0.35)
  Top 0.305: C7.1 R9.2 48.77,94.11 49.24,94.58 S1.3 | v14.12,92.58 15.63,92.58 U2.4
  Bottom 0.305: v14.12,92.58 8.78,92.58 7.39,93.97 7.39,98.78 X2.4 5.27,102.66 7.31,104.7 28.75,104.7 29.62,105.56 37.54,105.56 41.88,101.22 47.65,101.22 49.24,99.63 S1.3
ROW0  (via drill 0.35)
  Top 0.305: S4.2 S5.2 S6.2 S7.2 4.19,26.43 4.19,57.02 4.83,57.66 4.83,60.2 2.54,62.48 2.54,77.85 v5.46,80.77 | U2.6 17.15,91.83 16.02,91.83 15.11,90.93 v14.61,90.93
  Bottom 0.305: v14.61,90.93 14.61,89.92 v5.46,80.77
ROW1  (via drill 0.35)
  Top 0.305: S8.2 S9.2 S10.2 S11.2 5.59,44.03 5.59,56.39 6.1,56.9 6.1,60.71 4.06,62.74 4.06,77.47 v7.37,80.77 | U2.7 17.38,90.93 v16.38,90.93
  Bottom 0.305: v16.38,90.93 16.38,89.79 v7.37,80.77
ROW2  (via drill 0.35)
  Top 0.305: S12.2 S13.2 S14.2 S15.2 5.59,63.03 5.59,77.09 v9.27,80.77 | U2.8 17.91,90.33 v17.91,90.3
  Bottom 0.305: v17.91,90.3 17.91,89.41 v9.27,80.77
ROW3  (via drill 0.35)
  Top 0.305: S16.2 S17.2 S18.2 S19.2 11.18,76.44 v11.18,80.77 | v20.07,90.42 21.08,91.44 U2.9
  Bottom 0.305: v11.18,80.77 20.07,89.66 v20.07,90.42
SCL  (via drill 0.35)
  Top 0.305: U2.29 18.95,96.99 v18.95,95.61 | R17.2 4.76,93.22 5.27,93.73 8.08,93.73 X3.4
  Bottom 0.305: v18.95,95.61 17.22,93.88 10.85,93.88 X3.4
SDA  (via drill 0.35)
  Top 0.305: U2.30 17.5,97.31 v17.5,97.28 | R18.2 11.09,92.43 11.09,96.19 X3.3
  Bottom 0.305: v17.5,97.28 15.21,95 12.27,95 X3.3
SWCLK  (via drill 0.35)
  Top 0.305: v20.14,107.04 20.14,102.36 U2.24
  Bottom 0.305: v20.14,107.04 6.2,107.04 1.21,102.04 1.21,98.62 X2.1
SWDIO  (via drill 0.35)
  Top 0.305: v21.51,105.87 22.45,104.93 22.45,101.67 U2.23
  Bottom 0.305: v21.51,105.87 6.8,105.87 2.73,101.79 X2.3

### Text on the board
tPlace: VCC | GND | BOOT | STM32L412K8T6 | K0N16-Keypad / Version 1.1 - 13.12.2022 / Design by Hannes Heilmann | OLED
bPlace: SWD | RST / DIO / GND / CLK
tNames: 3V3 | GND | SDA | RST | SCL | BTN